# EAGLE design mikro (EAGLE 5.10)
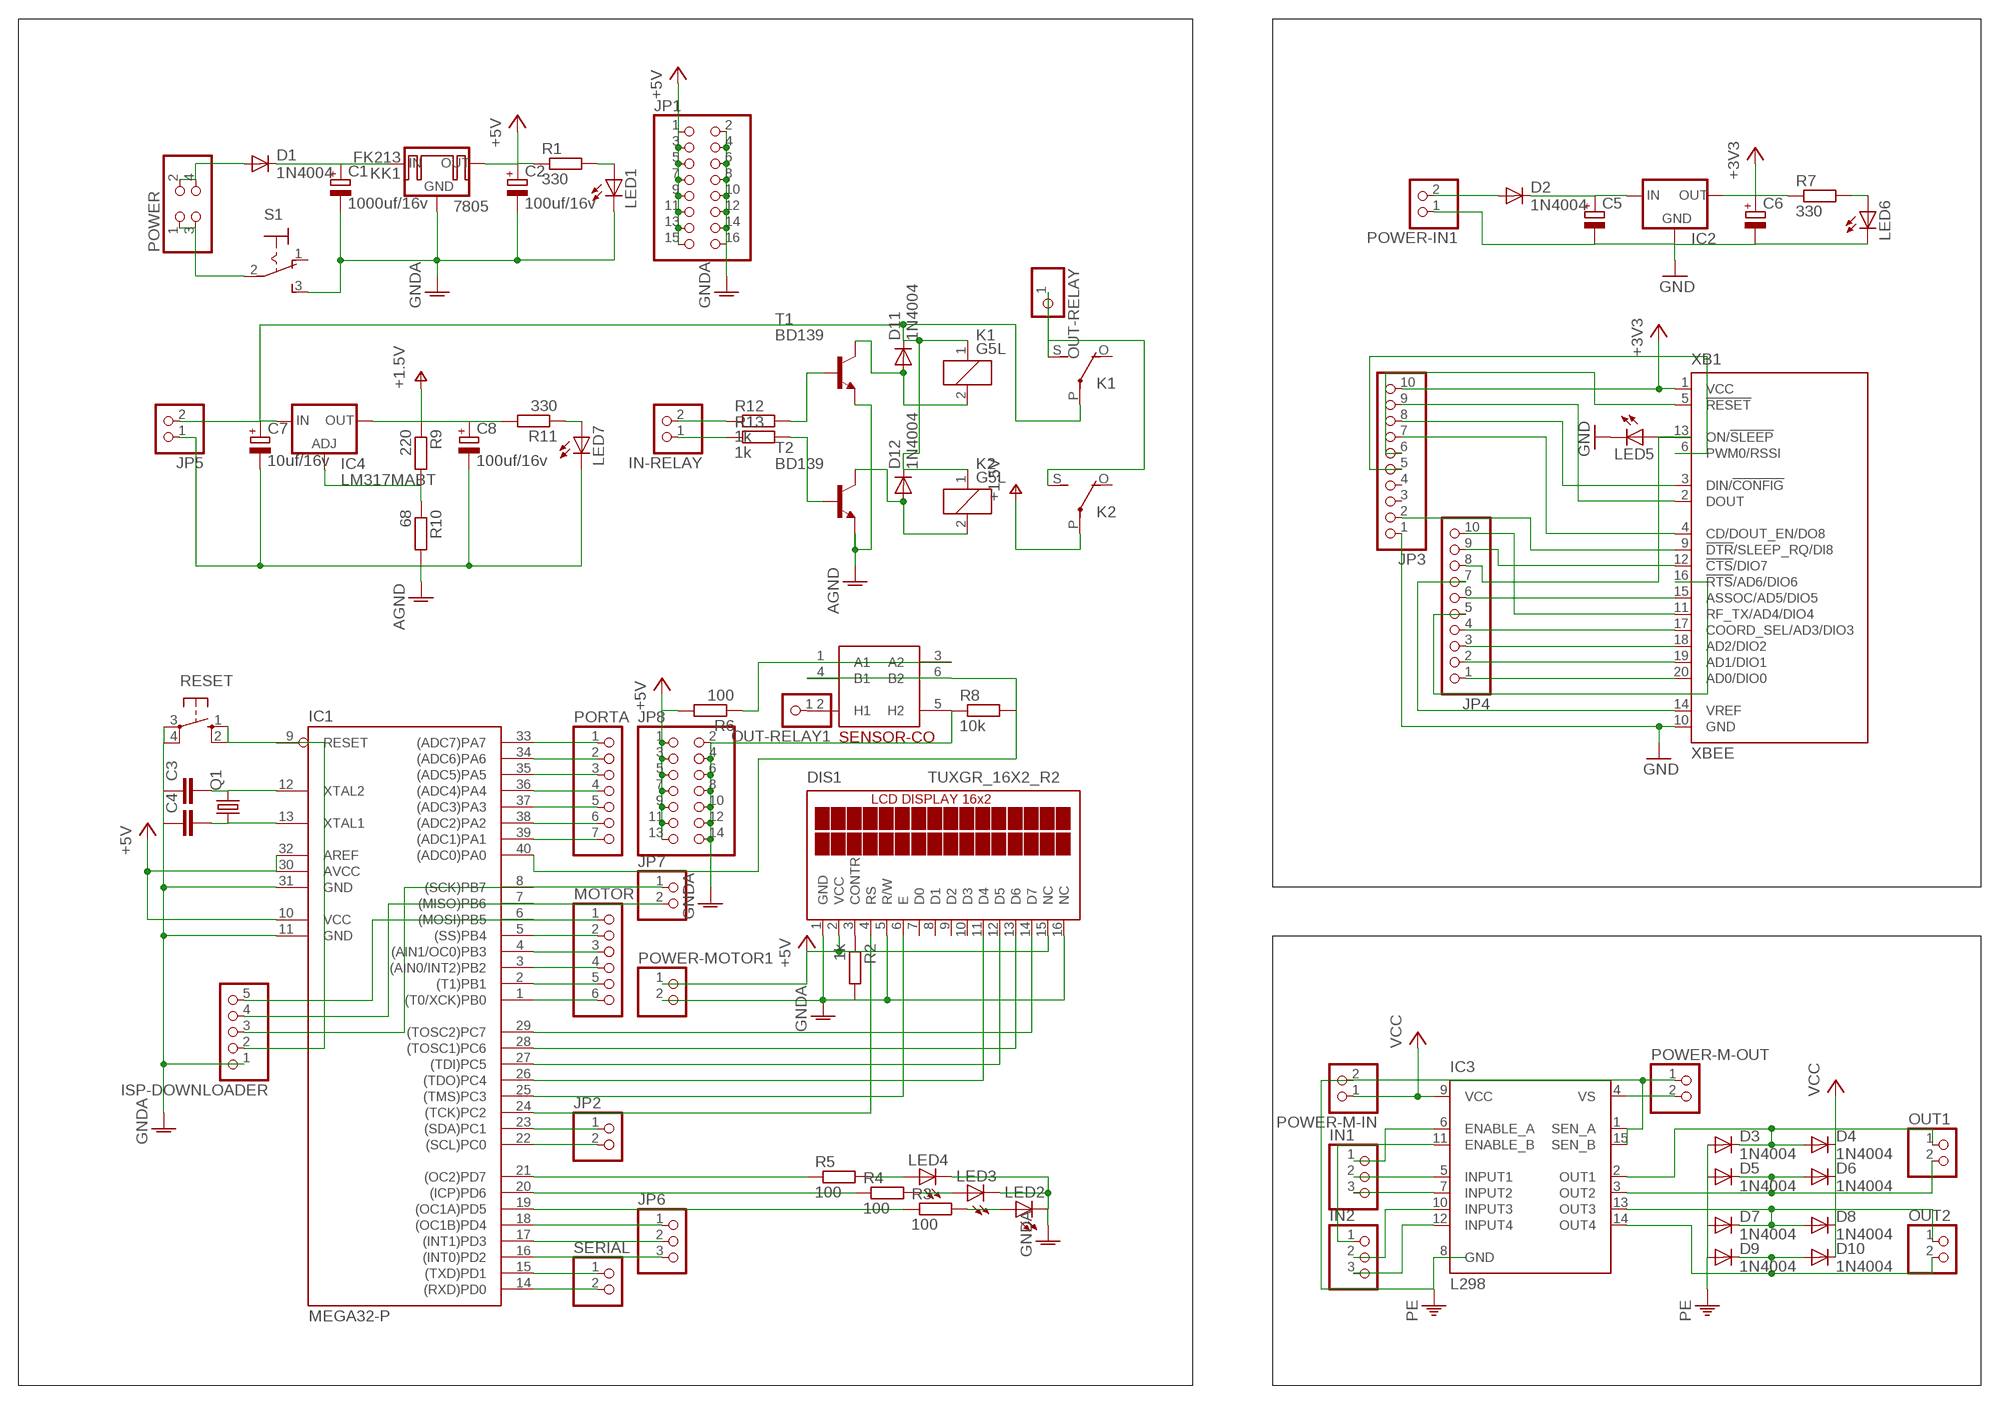
[diagram p0: schematic, sheet 1]

## Parts
7805  78XXS  [78XXS]
C1  1000uf/16v  CPOL-EUE2.5-7  [E2,5-7]
C2  100uf/16v  CPOL-EUE2.5-7  [E2,5-7]
C3  C-EU025-025X050  [C025-025X050]
C4  C-EU025-025X050  [C025-025X050]
C5  CPOL-EUE2.5-7  [E2,5-7]
C6  CPOL-EUE2.5-7  [E2,5-7]
C7  10uf/16v  CPOL-EUE2.5-7  [E2,5-7]
C8  100uf/16v  CPOL-EUE2.5-7  [E2,5-7]
D1  1N4004  [DO41-10]
D2  1N4004  [DO41-10]
D3  1N4004  [DO41-10]
D4  1N4004  [DO41-10]
D5  1N4004  [DO41-10]
D6  1N4004  [DO41-10]
D7  1N4004  [DO41-10]
D8  1N4004  [DO41-10]
D9  1N4004  [DO41-10]
D10  1N4004  [DO41-10]
D11  1N4004  [DO41-10]
D12  1N4004  [DO41-10]
DIS1  TUXGR_16X2_R2  [TUXGR_16X2_R2]
IC1  MEGA32-P  [DIL40]
IC2  78LXX  [78LXX]
IC3  L298  [MULTIWATT-15]
IC4  LM317MABT  [TO220L1]
IN1  PINHD-1X3  [1X03]
IN2  PINHD-1X3  [1X03]
IN-RELAY  PINHD-1X2  [1X02]
ISP-DOWNLOADER  PINHD-1X5  [1X05]
JP1  PINHD-2X8  [2X08]
JP2  PINHD-1X2  [1X02]
JP3  PINHD-1X10  [1X10]
JP4  PINHD-1X10  [1X10]
JP5  PINHD-1X2  [1X02]
JP6  PINHD-1X3  [1X03]
JP7  PINHD-1X2  [1X02]
JP8  PINHD-2X7  [2X07]
K1  G5L  [G5LE]
K2  G5L  [G5LE]
KK1  FK213  [FK213]
LED1  LED5MM  [LED5MM]
LED2  LED5MM  [LED5MM]
LED3  LED5MM  [LED5MM]
LED4  LED5MM  [LED5MM]
LED5  LED5MM  [LED5MM]
LED6  LED5MM  [LED5MM]
LED7  LED5MM  [LED5MM]
MOTOR  PINHD-1X6  [1X06]
OUT1  PINHD-1X2  [1X02]
OUT2  PINHD-1X2  [1X02]
OUT-RELAY  PINHD-1X1  [1X01]
OUT-RELAY1  PINHD-1X1  [1X01]
PORTA  PINHD-1X7  [1X07]
POWER  PINHD-2X2  [2X02]
POWER-IN1  PINHD-1X2  [1X02]
POWER-M-IN  PINHD-1X2  [1X02]
POWER-M-OUT  PINHD-1X2  [1X02]
POWER-MOTOR1  PINHD-1X2  [1X02]
Q1  CRYSTALHC18U-V  [HC18U-V]
R1  330  R-EU_0207/10  [0207/10]
R2  1k  R-EU_0207/10  [0207/10]
R3  100  R-EU_0207/10  [0207/10]
R4  100  R-EU_0207/10  [0207/10]
R5  100  R-EU_0207/10  [0207/10]
R6  100  R-EU_0207/10  [0207/10]
R7  330  R-EU_0207/10  [0207/10]
R8  10k  R-EU_0207/10  [0207/10]
R9  220  R-EU_0207/10  [0207/10]
R10  68  R-EU_0207/10  [0207/10]
R11  330  R-EU_0207/10  [0207/10]
R12  1k  R-EU_0207/10  [0207/10]
R13  1k  R-EU_0207/10  [0207/10]
RESET  10-XX  [B3F-10XX]
S1  320-916  [320-916]
SENSOR-CO  MQ  [MQ]
SERIAL  PINHD-1X2  [1X02]
T1  BD139  [TO126]
T2  BD139  [TO126]
XB1  XBEE  [XBEE]

## Nets
+3V3: C6.+ IC2.OUT JP3.10 R7.1 XB1.1(VCC)
+5V: 7805.OUT C2.+ DIS1.2(VCC) DIS1.15(NC) IC1.10(VCC) IC1.30(AVCC) IC1.32(AREF) JP1.1 JP1.3 JP1.5 JP1.7 JP1.9 JP1.11 JP1.13 JP1.15 JP8.1 JP8.3 JP8.5 JP8.7 JP8.9 JP8.11 JP8.13 POWER-MOTOR1.1 R1.1 R6.2
AGND: C7.- C8.- JP5.1 LED7.K(C) R10.2 T1.1(E) T2.1(E)
GND: C5.- C6.- IC2.GND JP3.1 LED5.K(C) LED6.K(C) POWER-IN1.1 XB1.10(GND)
GNDA: 7805.GND C1.- C2.- C3.1 C4.1 DIS1.1(GND) DIS1.5(R/W) DIS1.16(NC) IC1.11(GND) IC1.31(GND) ISP-DOWNLOADER.1 JP1.2 JP1.4 JP1.6 JP1.8 JP1.10 JP1.12 JP1.14 JP1.16 JP8.2 JP8.4 JP8.6 JP8.8 JP8.10 JP8.12 JP8.14 LED1.K(C) LED2.K(C) LED3.K(C) LED4.K(C) POWER-MOTOR1.2 R2.2 R8.1 RESET.3(P) RESET.4(P1) S1.3(S) SENSOR-CO.5(H2)
N$1: IC1.33((ADC7)PA7) PORTA.1
N$2: IC1.34((ADC6)PA6) PORTA.2
N$3: IC1.35((ADC5)PA5) PORTA.3
N$4: IC1.36((ADC4)PA4) PORTA.4
N$5: IC1.37((ADC3)PA3) PORTA.5
N$6: IC1.38((ADC2)PA2) PORTA.6
N$7: IC1.39((ADC1)PA1) PORTA.7
N$9: IC1.1((T0/XCK)PB0) MOTOR.6
N$10: JP3.9 XB1.2(DOUT)
N$11: LED5.A XB1.13(ON/!SLEEP)
N$12: C5.+ D2.C IC2.IN
N$13: IC1.2((T1)PB1) MOTOR.5
N$14: IC1.3((AIN0/INT2)PB2) MOTOR.4
N$15: DIS1.3(CONTR) R2.1
N$16: DIS1.14(D7) IC1.29((TOSC2)PC7)
N$17: DIS1.13(D6) IC1.28((TOSC1)PC6)
N$18: IC1.4((AIN1/OC0)PB3) MOTOR.3
N$19: IC1.5((SS)PB4) MOTOR.2
N$20: LED4.A R5.2
N$21: IC1.7((MISO)PB6) ISP-DOWNLOADER.4 JP7.2
N$22: LED2.A R3.2
N$23: LED3.A R4.2
N$24: POWER.1 POWER.3 S1.2(P)
N$25: OUT-RELAY1.1 SENSOR-CO.2(H1)
N$26: IC1.19((OC1A)PD5) R3.1
N$27: IC3.4(VS) POWER-M-OUT.2
N$28: DIS1.12(D5) IC1.27((TDI)PC5)
N$29: JP3.8 XB1.3(DIN/!CONFIG)
N$30: DIS1.11(D4) IC1.26((TDO)PC4)
N$31: IC1.20((ICP)PD6) R4.1
N$32: DIS1.6(E) IC1.25((TMS)PC3)
N$33: JP3.7 XB1.4(CD/DOUT_EN/DO8)
N$34: D2.A POWER-IN1.2
N$35: JP3.6 XB1.5(!RESET)
N$36: JP3.5 XB1.6(PWM0/RSSI)
N$37: JP3.2 XB1.9(!DTR!/SLEEP_RQ/DI8)
N$38: JP4.1 XB1.20(AD0/DIO0)
N$39: 7805.IN C1.+ D1.C
N$40: JP4.2 XB1.19(AD1/DIO1)
N$41: LED1.A R1.2
N$42: LED6.A R7.2
N$43: JP4.3 XB1.18(AD2/DIO2)
N$44: JP4.4 XB1.17(COORD_SEL/AD3/DIO3)
N$45: JP4.10 XB1.11(RF_TX/AD4/DIO4)
N$46: JP4.9 XB1.12(!CTS!/DIO7)
N$47: D1.A POWER.2 POWER.4
N$48: JP4.7 XB1.14(VREF)
N$49: JP4.8
N$50: JP4.6 XB1.15(ASSOC/AD5/DIO5)
N$51: JP4.5 XB1.16(!RTS!/AD6/DIO6)
N$52: DIS1.4(RS) IC1.24((TCK)PC2)
N$53: IC1.21((OC2)PD7) R5.1
N$54: IC1.23((SDA)PC1) JP2.1
N$55: IC4.1(ADJ) R9.2 R10.1
N$56: IC1.22((SCL)PC0) JP2.2
N$57: IC1.15((TXD)PD1) SERIAL.1
N$58: IC1.14((RXD)PD0) SERIAL.2
N$59: IC1.16((INT0)PD2) JP6.3
N$60: IC1.17((INT1)PD3) JP6.2
N$61: IC1.18((OC1B)PD4) JP6.1
N$62: IC1.9(RESET) ISP-DOWNLOADER.2 RESET.1(S) RESET.2(S1)
N$63: C3.2 IC1.12(XTAL2) Q1.2
N$64: C4.2 IC1.13(XTAL1) Q1.1
N$65: D3.C D4.A IC3.2(OUT1) OUT1.1
N$66: IC3.5(INPUT1) IN1.2
N$67: IC3.7(INPUT2) IN1.3
N$68: IC3.6(ENABLE_A) IN1.1
N$69: IC3.11(ENABLE_B) IN2.1
N$70: IC3.10(INPUT3) IN2.2
N$71: IC3.12(INPUT4) IN2.3
N$72: IN-RELAY.2 R12.1
N$73: IC1.8((SCK)PB7) ISP-DOWNLOADER.3 JP7.1
N$74: D5.C D6.A IC3.3(OUT2) OUT1.2
N$75: IC1.40((ADC0)PA0) R8.2 SENSOR-CO.4(B1) SENSOR-CO.6(B2)
N$76: D7.C D8.A IC3.13(OUT3) OUT2.1
N$77: IC1.6((MOSI)PB5) ISP-DOWNLOADER.5 MOTOR.1
N$78: D9.C D10.A IC3.14(OUT4) OUT2.2
N$79: IN-RELAY.1 R13.1
N$80: R6.1 SENSOR-CO.1(A1) SENSOR-CO.3(A2)
N$81: LED7.A R11.1
N$82: R12.2 T1.3(B)
N$84: R13.2 T2.3(B)
N$85: C7.+ D11.C D12.C IC4.3(IN) JP5.2 K1.1 K1.P(2:P) K2.1
N$86: D12.A K2.2 T2.2(C)
N$87: D11.A K1.2 T1.2(C)
N$94: K1.S(2:S) K2.S(2:S) OUT-RELAY.1
PE: D3.A D5.A D7.A D9.A IC3.1(SEN_A) IC3.8(GND) IC3.15(SEN_B) POWER-M-IN.2 POWER-M-OUT.1
V+: C8.+ IC4.2(OUT) K2.P(2:P) R9.1 R11.2 ; supply symbol labelled +1.5V
VCC: D4.C D6.C D8.C D10.C IC3.9(VCC) POWER-M-IN.1
Unconnected: DIS1.7(D0) DIS1.8(D1) DIS1.9(D2) DIS1.10(D3) JP3.3 JP3.4 K1.O(2:O) K2.O(2:O) S1.1(O)

## Notes on the sheet
- SENSOR-CO

## Library data of the parts
7805 = v-reg:78XXS: VOLTAGE REGULATOR
C1 C2 C5-C8 = rcl:CPOL-EU: POLARIZED CAPACITOR, European symbol
C3 C4 = rcl:C-EU: CAPACITOR, European symbol
D1-D12 = diode:1N4004: DIODE general purpose rectifier, 1 A
DIS1 = display-lcd:TUXGR_16X2_R2: Tuxgraphics LCD display 16x2 characters reflective, without background light Source: tuxgr_12x2_r2.pdf
IC1 = atmel:MEGA32-P: MICROCONTROLLER 32 Kbytes FLASH 2 Kbytes SRAM 1 Kbytes EEPROM USART 8-channel 10 bit ADC Source: www.atmel.com .. doc2503.pdf
IC2 = v-reg:78LXX: VOLTAGE REGULATOR
IC3 = st-microelectronics:L298: DUAL FULL-BRIDGE DRIVER
IC4 = v-reg:LM317?*: 500 mA Adjustable Output Positive Voltage Regulator Source: http://www.onsemi.co.jp .. LM317M-D.PDF
IN1 IN2 JP6 = pinhead:PINHD-1X3: PIN HEADER
IN-RELAY JP2 JP5 JP7 OUT1 OUT2 POWER-IN1 POWER-M-IN POWER-M-OUT POWER-MOTOR1 SERIAL = pinhead:PINHD-1X2: PIN HEADER
ISP-DOWNLOADER = pinhead:PINHD-1X5: PIN HEADER
JP1 = pinhead:PINHD-2X8: PIN HEADER
JP3 JP4 = pinhead:PINHD-1X10: PIN HEADER
JP8 = pinhead:PINHD-2X7: PIN HEADER
K1 K2 = relay:G5L: RELAY 1 x switch, 10 A/120 V AC, 8 A/30 V ADC, Omron
KK1 = heatsink:FK213: HEATSINK manufacturer Fischer/distributor Buerklin
LED1-LED7 = led:LED: LED OSRAM: - CHIPLED LG R971, LG N971, LY N971, LG Q971, LY Q971, LO R971, LY R971 LH N974, LH R974 LS Q976, LO Q976, LY Q976 LO Q996 - Hyper CHIPLED LW Q18S LB Q993, LB Q99A, LB R99A - SideLED LS A670, LO A670, LY A670, LG A670, LP A670 LB A673, LV A673, LT A673, LW A673 LH A674 LY A675 LS A676, LA A676, LO A676, LY A676, LW A676 LS A679, LY A679, LG A679 - Hyper Micro SIDELED® LS Y876, LA Y876, LO Y876, LY Y876 LT Y87S - SmartLED LW L88C, LW L88S LB L89C, LB L89S, LG L890 LS L89K, LO L89K, LY L89K LS L896, LA L896, LO L896, LY L896 - TOPLED LS T670, LO T670, LY T670, LG T670, LP T670 LSG T670, LSP T670, LSY T670, LOP T670, LYG T670 LG T671, LOG T671, LSG T671 LB T673, LV T673, LT T673, LW T673 LH T674 LS T676, LA T676, LO T676, LY T676, LB T676, LH T676, LSB T676, LW T676 LB T67C, LV T67C, LT T67C, LS T67K, LO T67K, LY T67K, LW E67C LS E67B, LA E67B, LO E67B, LY E67B, LB E67C, LV E67C, LT E67C LW T67C LS T679, LY T679, LG T679 LS T770, LO T770, LY T770, LG T770, LP T770 LB T773, LV T773, LT T773, LW T773 LH T774 LS E675, LA E675, LY E675, LS T675 LS T776, LA T776, LO T776, LY T776, LB T776 LHGB T686 LT T68C, LB T68C - Hyper Mini TOPLED® LB M676 - Mini TOPLED Santana® LG M470 LS M47K, LO M47K, LY M47K Source: http://www.osram.convergy.de LUXEON: - LUMILED® LXK2-PW12-R00, LXK2-PW12-S00, LXK2-PW14-U00, LXK2-PW14-V00 LXK2-PM12-R00, LXK2-PM12-S00, LXK2-PM14-U00 LXK2-PE12-Q00, LXK2-PE12-R00, LXK2-PE12-S00, LXK2-PE14-T00, LXK2-PE14-U00 LXK2-PB12-K00, LXK2-PB12-L00, LXK2-PB12-M00, LXK2-PB14-N00, LXK2-PB14-P00, LXK2-PB14-Q00 LXK2-PR12-L00, LXK2-PR12-M00, LXK2-PR14-Q00, LXK2-PR14-R00 LXK2-PD12-Q00, LXK2-PD12-R00, LXK2-PD12-S00 LXK2-PH12-R00, LXK2-PH12-S00 LXK2-PL12-P00, LXK2-PL12-Q00, LXK2-PL12-R00 Source: www.luxeon.com KINGBRIGHT: KA-3528ASYC Source: www.kingbright.com
MOTOR = pinhead:PINHD-1X6: PIN HEADER
OUT-RELAY OUT-RELAY1 = pinhead:PINHD-1X1: PIN HEADER
PORTA = pinhead:PINHD-1X7: PIN HEADER
POWER = pinhead:PINHD-2X2: PIN HEADER
Q1 = crystal:CRYSTAL: CRYSTAL
R1-R13 = rcl:R-EU_: RESISTOR, European symbol
RESET = switch-omron:10-XX: OMRON SWITCH
S1 = switch:320-916: TOGGLE SWITCH distributor RS Components
SENSOR-CO = MQ:MQ
T1 T2 = transistor:BD139: NPN TRANSISTOR
XB1 = maxstream:XBEE: XBee (TM) /XBee-PRO(TM) OEM RF Modules Source: MaxStream, Inc. xbee_productmanual.pdf

## Board
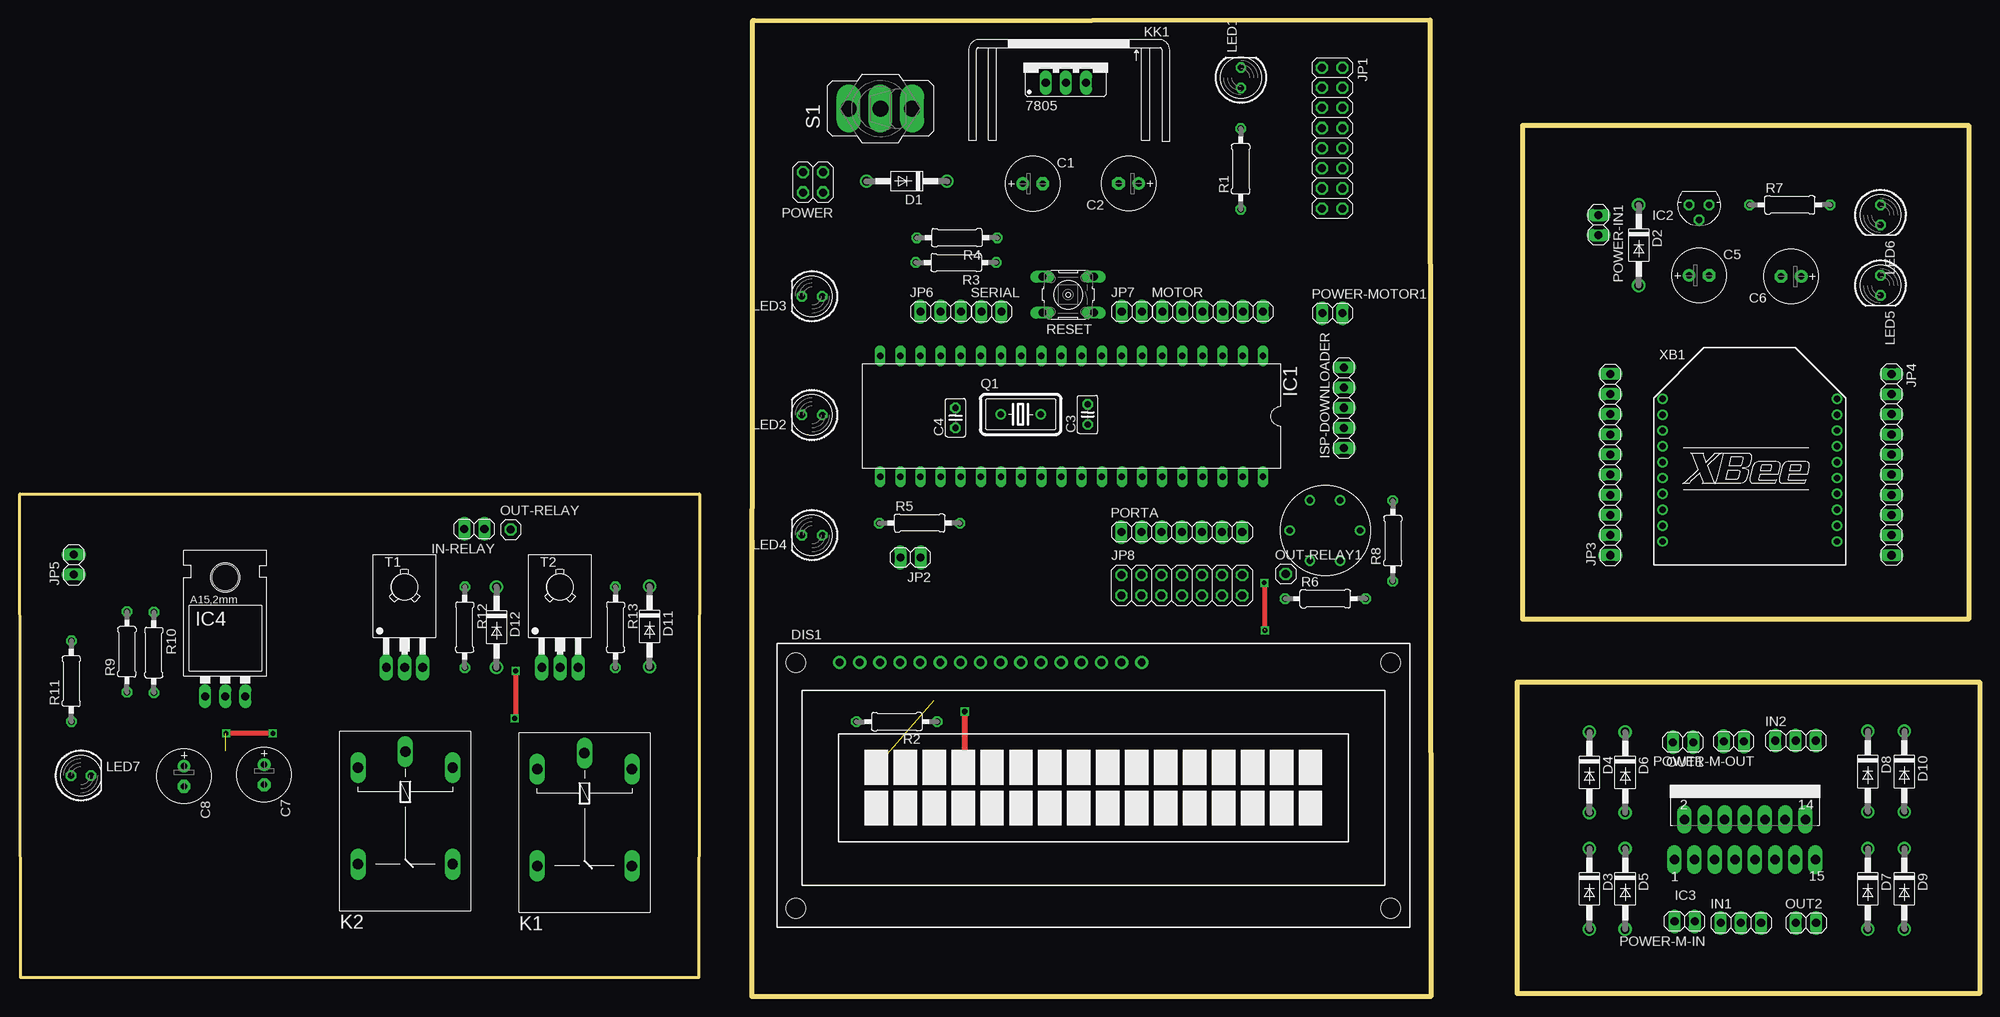
[diagram p1: board, top side]
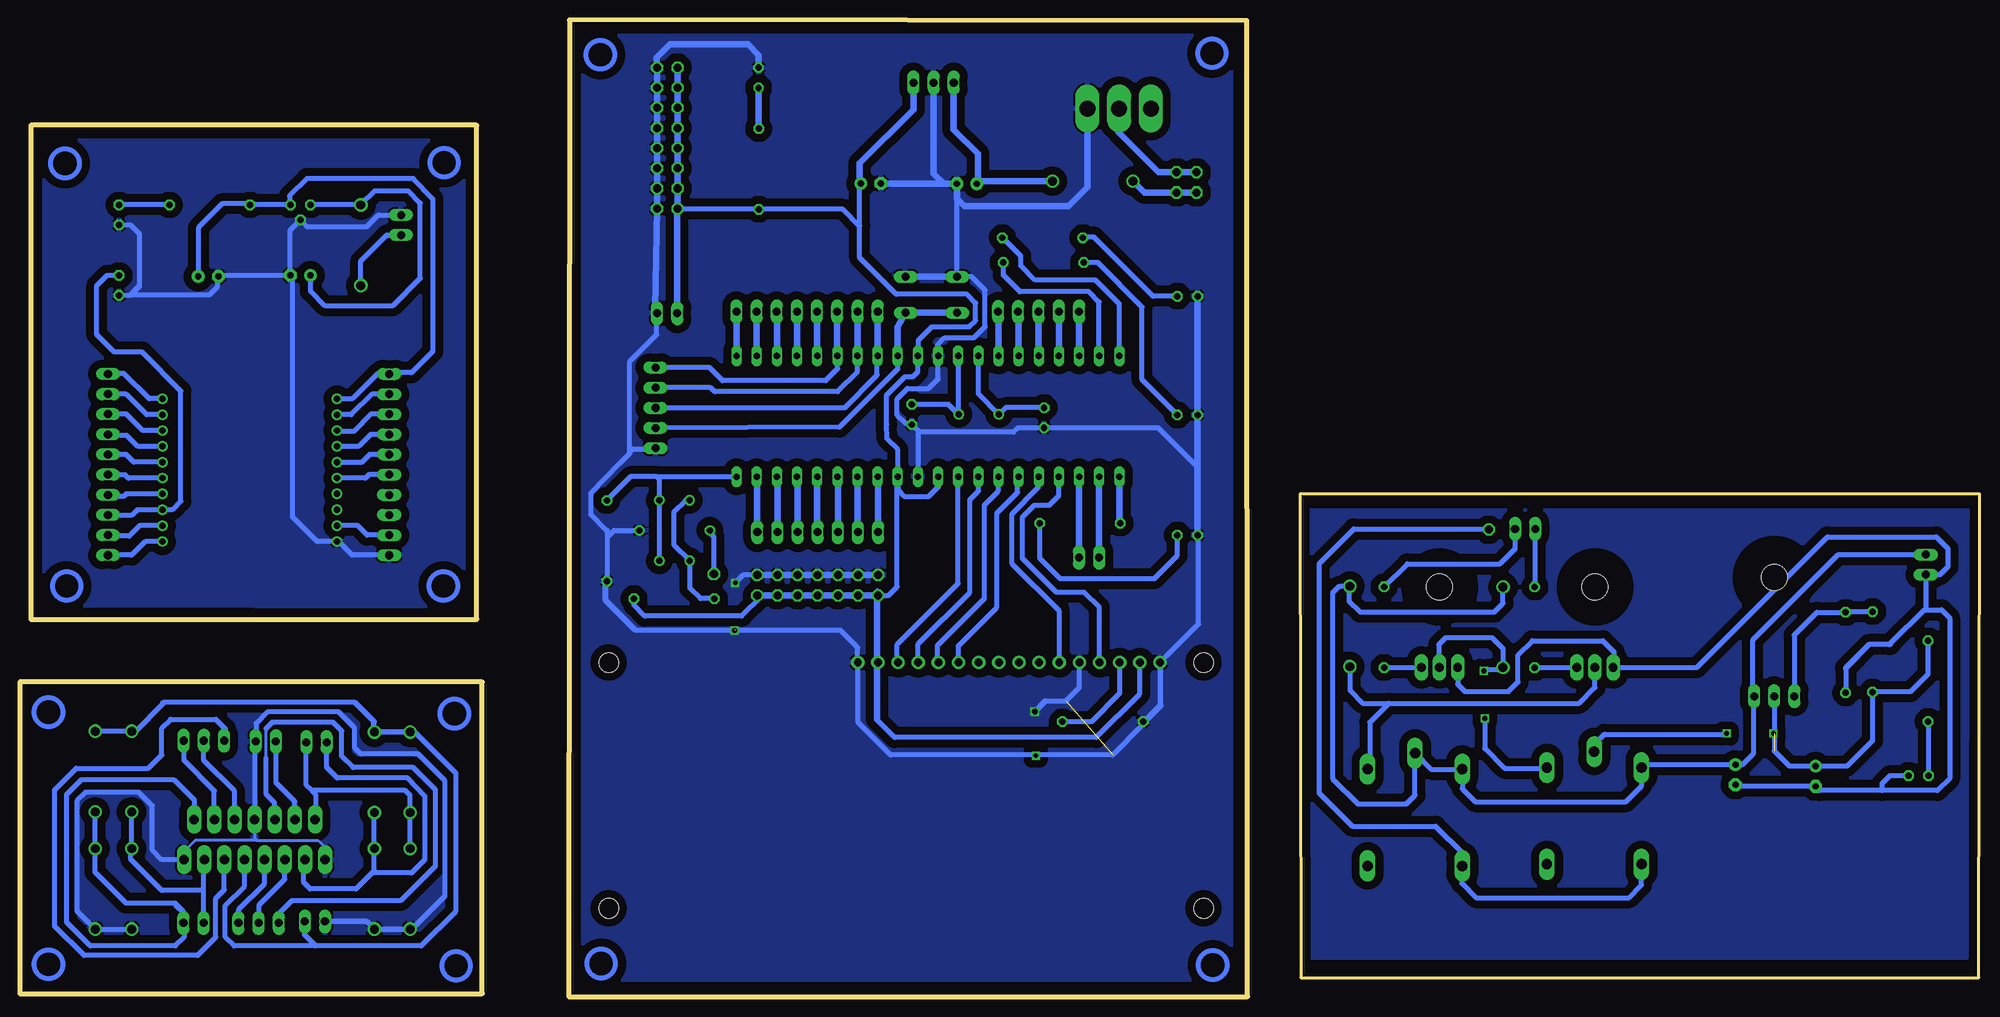
[diagram p2: board, bottom side, seen from below]

Size 247.1 x 123.2 mm. Coordinates in mm from the lower left corner, seen from the top.
Outline: 92.6,123.1 177.8,123.2 177.9,0 92.3,0 92.4,123.1
Outline: 189.5,109.9 245.7,109.9 245.7,47.6 189.5,47.6 189.5,109.9
Outline: 247.1,39.7 247.1,0.4 188.8,0.4 188.8,39.7 247.1,39.7
Outline: 85.7,63.4 85.6,2.4 0.1,2.4 0,63.4 85.7,63.4
Copper layers (1*16): Top 0.035mm / dielectric 1.5mm / Bottom 0.035mm
Design rules "default": minimum track width 10mil, minimum drill 24mil, track to track 8mil, track to pad 8mil, pad to pad 8mil, via to via 8mil, smd to smd 8mil, copper to edge 40mil, drill to drill 8mil, minimum pad ring 10mil, minimum via ring 8mil, stop-mask expansion 4mil, vias tented up to drill 0mil, thermal gap 10mil

### Footprints (pad centres in the part's own frame; a part is rotated, then mirrored left to right if it is on the bottom)
78XXS = drill 1.016 long: GND 0,-2.54; IN -2.54,-2.54; OUT 2.54,-2.54
E2,5-7 = drill 0.813 pad 1.6 round: + -1.27,0 | drill 0.813 pad 1.6 octagon: - 1.27,0
C025-025X050 = drill 0.813 octagon: 1 -1.27,0; 2 1.27,0
DO41-10 = drill 1.118 round: A 5.08,0; C -5.08,0
TUXGR_16X2_R2 = drill 1 pad 1.676 round: 1 -32,15.5; 2 -29.46,15.5; 3 -26.92,15.5; 4 -24.38,15.5; 5 -21.84,15.5; 6 -19.3,15.5; 7 -16.76,15.5; 8 -14.22,15.5; 9 -11.68,15.5; 10 -9.14,15.5; 11 -6.6,15.5; 12 -4.06,15.5; 13 -1.52,15.5; 14 1.02,15.5; 15 3.56,15.5; 16 6.1,15.5 | hole 2.5: -37.5,-15.5; 37.5,-15.5; -37.5,15.5; 37.5,15.5
DIL40 = drill 0.813 long: 1 -24.13,-7.62; 2 -21.59,-7.62; 3 -19.05,-7.62; 4 -16.51,-7.62; 5 -13.97,-7.62; 6 -11.43,-7.62; 7 -8.89,-7.62; 8 -6.35,-7.62; 9 -3.81,-7.62; 10 -1.27,-7.62; 11 1.27,-7.62; 12 3.81,-7.62; 13 6.35,-7.62; 14 8.89,-7.62; 15 11.43,-7.62; 16 13.97,-7.62; 17 16.51,-7.62; 18 19.05,-7.62; 19 21.59,-7.62; 20 24.13,-7.62; 21 24.13,7.62; 22 21.59,7.62; 23 19.05,7.62; 24 16.51,7.62; 25 13.97,7.62; 26 11.43,7.62; 27 8.89,7.62; 28 6.35,7.62; 29 3.81,7.62; 30 1.27,7.62; 31 -1.27,7.62; 32 -3.81,7.62; 33 -6.35,7.62; 34 -8.89,7.62; 35 -11.43,7.62; 36 -13.97,7.62; 37 -16.51,7.62; 38 -19.05,7.62; 39 -21.59,7.62; 40 -24.13,7.62
78LXX = drill 0.813 octagon: GND 0,1.905; IN 1.27,0; OUT -1.27,0
MULTIWATT-15 = drill 1.2 long: 1 -8.89,-7.62; 2 -7.62,-2.54; 3 -6.35,-7.62; 4 -5.08,-2.54; 5 -3.81,-7.62; 6 -2.54,-2.54; 7 -1.27,-7.62; 8 0,-2.54; 9 1.27,-7.62; 10 2.54,-2.54; 11 3.81,-7.62; 12 5.08,-2.54; 13 6.35,-7.62; 14 7.62,-2.54; 15 8.89,-7.62
TO220L1 = drill 1.016 long: 1 -2.54,-3.81; 2 0,-3.81; 3 2.54,-3.81 | hole 3.302: 0,11.176
1X03 = drill 1.016 long: 1 -2.54,0; 2 0,0; 3 2.54,0
1X02 = drill 1.016 long: 1 -1.27,0; 2 1.27,0
1X05 = drill 1.016 long: 1 -5.08,0; 2 -2.54,0; 3 0,0; 4 2.54,0; 5 5.08,0
2X08 = drill 1.016 octagon: 1 -8.89,-1.27; 2 -8.89,1.27; 3 -6.35,-1.27; 4 -6.35,1.27; 5 -3.81,-1.27; 6 -3.81,1.27; 7 -1.27,-1.27; 8 -1.27,1.27; 9 1.27,-1.27; 10 1.27,1.27; 11 3.81,-1.27; 12 3.81,1.27; 13 6.35,-1.27; 14 6.35,1.27; 15 8.89,-1.27; 16 8.89,1.27
1X10 = drill 1.016 long: 1 -11.43,0; 2 -8.89,0; 3 -6.35,0; 4 -3.81,0; 5 -1.27,0; 6 1.27,0; 7 3.81,0; 8 6.35,0; 9 8.89,0; 10 11.43,0
2X07 = drill 1.016 octagon: 1 -7.62,-1.27; 2 -7.62,1.27; 3 -5.08,-1.27; 4 -5.08,1.27; 5 -2.54,-1.27; 6 -2.54,1.27; 7 0,-1.27; 8 0,1.27; 9 2.54,-1.27; 10 2.54,1.27; 11 5.08,-1.27; 12 5.08,1.27; 13 7.62,-1.27; 14 7.62,1.27
G5LE = drill 1.321 long: 1 -7.493,-5.969; 2 -7.493,5.969; O 4.699,5.969; P -9.525,0; S 4.699,-5.969
LED5MM = drill 0.813 octagon: A -1.27,0; K 1.27,0
1X06 = drill 1.016 long: 1 -6.35,0; 2 -3.81,0; 3 -1.27,0; 4 1.27,0; 5 3.81,0; 6 6.35,0
1X01 = drill 1.016 octagon: 1 0,0
1X07 = drill 1.016 long: 1 -7.62,0; 2 -5.08,0; 3 -2.54,0; 4 0,0; 5 2.54,0; 6 5.08,0; 7 7.62,0
2X02 = drill 1.016 octagon: 1 -1.27,-1.27; 2 -1.27,1.27; 3 1.27,-1.27; 4 1.27,1.27
HC18U-V = drill 0.813 round: 1 -2.54,0; 2 2.54,0
0207/10 = drill 0.813 octagon: 1 -5.08,0; 2 5.08,0
B3F-10XX = drill 1.016 long: 1 -3.251,2.261; 2 3.251,2.261; 3 -3.251,-2.261; 4 3.251,-2.261
320-916 = drill 2.007 long: 1 0,4.013; 2 0,0; 3 0,-4.013
MQ = drill 0.8 round: 1 -3.81,2.54; 2 0,5.08; 3 3.81,2.54; 4 -3.81,-1.27; 5 0,-3.81; 6 3.81,-1.27
TO126 = drill 1.118 long: 1 -2.286,-5.08; 2 0,-5.08; 3 2.286,-5.08 | hole 3.302: 0,5.08
XBEE = drill 0.8 pad 1.27 round: 1 -11,9; 2 -11,7; 3 -11,5; 4 -11,3; 5 -11,1; 6 -11,-1; 7 -11,-3; 8 -11,-5; 9 -11,-7; 10 -11,-9; 11 11,-9; 12 11,-7; 13 11,-5; 14 11,-3; 15 11,-1; 16 11,1; 17 11,3; 18 11,5; 19 11,7; 20 11,9

### Placement (x,y rotation side)
7805  131.89,117.81 0 top
C1  127.7,102.54 0 top
C2  139.8,102.56 180 top
C3  134.63,73.43 90 top
C4  117.97,73.02 90 top
C5  211.73,90.97 0 top
C6  223.34,90.83 180 top
C7  30.8,28 270 top
C8  20.7,27.8 270 top
D1  111.83,102.85 180 top
D2  204.11,94.78 270 top
D3  197.9,13.6 270 top
D4  197.9,28.3 270 top
D5  202.4,13.6 270 top
D6  202.4,28.3 270 top
D7  233,13.6 270 top
D8  233,28.4 270 top
D9  237.6,13.6 270 top
D10  237.6,28.4 270 top
D11  79.4,46.7 270 top
D12  60.1,46.6 270 top
DIS1  135.35,26.65 0 top
IC1  132.6,73.2 180 top
IC2  211.73,99.86 180 top
IC3  217.5,24.9 0 top
IC4  25.9,41.7 0 top
IN1  217,9.3 0 top
IN2  223.9,32.3 0 top
IN-RELAY  57.3,59 180 top
ISP-DOWNLOADER  166.96,74.27 90 top
JP1  165.46,108.29 270 top
JP2  112.3,55.4 180 top
JP3  200.53,67.11 90 top
JP4  235.99,67.11 270 top
JP5  6.8,54.5 90 top
JP6  116.1,86.4 0 top
JP7  140.2,86.4 0 top
JP8  146.5,51.9 0 top
K1  71.2,21.2 270 top
K2  48.6,21.4 270 top
KK1  132.3,119.7 180 top
LED1  153.96,115.9 90 top
LED2  99.88,73.36 180 top
LED3  99.88,88.34 180 top
LED4  99.88,58.22 180 top
LED5  234.59,89.7 270 top
LED6  234.59,98.59 270 top
LED7  7.7,27.9 0 top
MOTOR  150.4,86.4 0 top
OUT1  209.7,32.1 180 top
OUT2  225.2,9.3 0 top
OUT-RELAY  61.9,58.9 0 top
OUT-RELAY1  159.6,53.3 0 top
PORTA  146.5,58.6 0 top
POWER  100,102.7 180 top
POWER-IN1  199.03,97.32 270 top
POWER-M-IN  209.9,9.5 180 top
POWER-M-OUT  216.1,32.2 180 top
POWER-MOTOR1  165.5,86.2 0 top
Q1  126.19,73.45 0 top
R1  153.93,104.4 90 top
R2  110.57,34.69 180 top
R3  118.05,92.59 180 top
R4  118.15,95.73 180 top
R5  113.45,59.73 0 top
R6  164.6,50.2 0 top
R7  223.16,99.86 0 top
R8  173.1,57.5 90 top
R9  13.5,43.5 90 top
R10  16.9,43.4 270 top
R11  6.5,39.8 90 top
R12  56.1,46.6 270 top
R13  75.1,46.6 270 top
RESET  132.17,88.53 180 top
S1  108.5,112 90 top
SENSOR-CO  165.2,58.8 90 top
SERIAL  122.5,86.38 0 top
T1  48.5,46.6 0 top
T2  68.1,46.6 0 top
XB1  218.11,66.41 0 top

### Tracks (layer width: path | path; a pad name or v marks a point on that pad's centre or on a via)
+3V3
  Bottom 0.61: C6.+ 224.61,96.99 221.6,100 218.22,100 R7.1 IC2.OUT 213.1,99.96 213.1,101 210.9,103.2 197.5,103.2 195,100.6 195,81.4 197.7,78.7 200.37,78.7 JP3.10 202.06,78.54 205.2,75.4 XB1.1 207.11,75.49
+5V
  Bottom 0.61: IC1.30 131.33,64.27 132.5,63.1 135.6,63.1 136.4,63.9 IC1.32 | 133.87,80.3 133.87,78.83 134.5,78.2 135.5,78.2 137.8,75.9 137.8,72.2 137.75,70.35 136.4,69 136.4,65.99 IC1.32 | 133.87,80.3 IC1.10 | 138.91,34.81 DIS1.15 138.91,51.11 139,51.2 139,50.75 JP8.1 137.57,50.63 136.5,51.7 136.5,65.49 IC1.32 | 138.91,34.81 136.8,32.7 111.4,32.7 105.9,38.2 DIS1.2 | R6.2 169.68,49.38 168.3,48 156.1,48 153.6,50.5 139,50.5 139.1,50.4 139.1,35 138.91,34.81 | 141.2,97.2 141.2,93.2 136.6,88.6 127.7,88.6 126.6,87.5 126.6,85.3 127.4,84.5 132.1,84.5 133.8,82.8 133.8,80.37 133.87,80.3 | 141.2,97.2 141.2,102.69 | 141.2,97.2 143.32,99.32 R1.1 164.11,99.32
  Bottom 0.813: JP1.1 JP1.3 JP1.5 JP1.7 JP1.9 JP1.11 JP1.13 JP1.15 | JP8.13 JP8.11 JP8.9 JP8.7 JP8.5 JP8.3 JP8.1 | 7805.OUT 134.43,111.87 141.2,105.1 141.2,102.69 C2.+ | 164.11,99.32 JP1.15 | POWER-MOTOR1.1 164.23,99.36 JP1.15
AGND
  Bottom 0.61: C7.- 30.6,26.53 C8.- 20.17,26 12.3,26 | 7,48.8 6.8,49 JP5.1 6.77,53.2 5,53.2 4,54.2 4,56.5 5.5,58 19.2,58 35.68,41.52 T1.1 46.1,41.63 46.1,43.5 47.5,44.9 56.4,44.9 58.2,43.1 58.2,39.7 59.4,38.5 64.9,38.5 65.81,39.41 T2.1 | 11.2,44.6 11.4,44.4 13.9,44.4 16.9,41.4 R10.2 16.9,41.5 14,44.4 11.3,44.4 11.2,44.5 11.2,44.6 | 7,48.8 11.2,44.6 | 7,48.8 4.8,48.8 3.8,47.8 3.8,27.5 5.3,26 12.3,26 | LED7.K 11.3,27.9 12.3,26.9 12.3,26
GND
  Bottom 0.61: 200.45,55.6 199.9,55.6 200,55.7 205.2,55.7 206.91,57.41 XB1.10 209.61,57.41 212.7,60.5 212.7,90.67 C5.- | C5.- 221.93,90.97 C6.- 222.2,90.7 222.2,89.5 223.2,88.5 233.2,88.5 232.1,89.6 232,89.6 | LED5.K 233.17,88.43 232,89.6 | 232,89.6 232,96.2 233.1,97.3 234.57,97.3 LED6.K | POWER-IN1.1 201.91,98.59 203.4,97.1 210.88,97.1 IC2.GND 213,96.69 C5.-
  pour Bottom (isolate 1.016): 244.1,107.9 244.2,49.4 190.8,49.3 190.9,107.9
GNDA  (via drill 0.6)  (2 unrouted)
  Top 0.61: v119.2,36 119.2,30.7 119,30.5 | v119.1,35.9 v119.1,36 | v119.1,35.9 119.1,30.5 | v156.9,52.2 156.9,46.3 156.8,46.2 | v119.1,35.9 119.1,30.7 119.3,30.5
  Bottom 0.61: 128,99.7 128.92,100.58 RESET.4 127.09,90.79 125.4,89.1 125.4,84.5 126.8,83.1 130.5,83.1 131.4,82.2 131.4,80.89 IC1.11 131.33,77.87 132.5,76.7 135.2,76.7 136.5,75.4 136.5,73.3 135.4,72.3 134.77,72.3 C3.1 133.87,71.4 | 133.87,71.4 133.67,71.2 121.8,71.2 121.25,71.75 C4.1 103.56,71.75 98.61,66.8 | ISP-DOWNLOADER.1 167.05,69.1 169.8,69.1 170.2,68.7 | 133.87,71.4 IC1.31 | R2.2 105.21,34.69 103.2,36.7 103.2,42 DIS1.1 | 98.49,58.1 98.49,47.01 DIS1.1 | DIS1.1 103.35,36.75 105.6,34.5 105.6,34.2 109.3,30.5 137.3,30.5 141.4,34.6 141.4,42.1 DIS1.16 141.45,44.05 143.6,46.2 v157,46.2 169.4,46.2 | DIS1.5 113.51,38.99 115.2,37.3 117.7,37.3 | 169.4,46.2 173.2,50 173.2,52.32 | 169.4,46.2 169.5,46.2 173.3,50 173.3,52.5 173,52.8 173,58 | 173,58 173,58.8 173.1,58.8 175.1,60.8 175.1,63.5 171.4,67.3 170.2,68.5 170.2,68.7 | 170.2,68.7 170.2,80.1 166.8,83.5 166.8,86.17 POWER-MOTOR1.2 | 117.7,37.3 117.8,37.3 | v119.1,36 117.8,37.3 | 117.8,37.3 117.9,37.3 v119.2,36 119.2,36.2 | SENSOR-CO.5 172.2,58.8 173,58 | JP8.6 155.93,53.17 v156.9,52.2 | v119.1,35.9 117.7,37.3
  Bottom 0.813: RESET.4 RESET.3 | JP8.2 JP8.4 JP8.6 JP8.8 JP8.10 JP8.12 JP8.14 | LED3.K LED2.K 98.61,66.8 98.61,58.71 98.6,58.1 98.49,58.1 LED4.K | S1.3 112.5,111.99 112.5,102.1 114.9,99.7 128,99.7 128.97,100.67 C1.- 130.6,102.54 | 130.6,102.54 138.51,102.54 C2.- | 7805.GND 131.89,103.83 130.6,102.54 | POWER-MOTOR1.2 167,86.2 167,86.8 166.77,99.36 JP1.16 JP1.14 JP1.12 JP1.10 JP1.8 JP1.6 JP1.4 JP1.2 166.8,117.25 166.8,118.4 165.1,120.1 155.3,120.1 153.96,118.76 LED1.K
  pour Bottom (isolate 1.016): 94.5,121.1 176.1,121.1 176.1,2.2 94.4,2.2 94.4,121
N$1
  Bottom 0.813: PORTA.1 138.88,65.51 IC1.33
N$2
  Bottom 0.813: IC1.34 141.49,58.67 PORTA.2
N$3
  Bottom 0.813: PORTA.3 143.96,65.51 IC1.35
N$4
  Bottom 0.813: IC1.36 146.57,58.67 PORTA.4
N$5
  Bottom 0.813: PORTA.5 149.04,65.51 IC1.37
N$6
  Bottom 0.813: PORTA.6 151.58,65.51 IC1.38
N$7
  Bottom 0.813: PORTA.7 154.12,65.51 IC1.39
N$8  (via drill 0.6)
  other vias: 119,30.4
N$9
  Bottom 0.813: IC1.1 156.75,80.82 MOTOR.6
N$10
  Bottom 0.61: JP3.9 202.7,76 205.3,73.4 XB1.2
N$11
  Bottom 0.61: LED5.A 234.62,91 236.1,91 237.4,89.7 237.4,83.5 235.2,81.3 231.7,81.3 226.8,76.4 226.8,62.5 227.89,61.41 XB1.13 232.29,61.41 233,60.7 235.8,60.7 235.9,60.8
N$12
  Bottom 0.61: IC2.IN D2.C 202.37,101.6 198.1,101.6 196.6,100.1 196.6,90.6 200.1,87.1 208.6,87.1 210.46,88.96 C5.+
N$13
  Bottom 0.813: MOTOR.5 154.19,86.5 IC1.2
N$14
  Bottom 0.813: MOTOR.4 151.65,86.5 IC1.3
N$15
  Bottom 0.61: R2.1 112.01,34.69 108.4,38.3 108.4,42.12 DIS1.3
N$16
  Bottom 0.61: IC1.29 128.79,52.11 136.5,44.4 136.5,42.28 DIS1.14
N$17
  Bottom 0.61: DIS1.13 133.83,44.47 127.3,51 127.3,62.7 126.2,63.8 126.2,65.53 IC1.28
N$18
  Bottom 0.813: MOTOR.3 149.11,86.5 IC1.4
N$19
  Bottom 0.813: MOTOR.2 146.57,86.5 IC1.5
N$20
  Bottom 0.61: LED4.A 101.15,55.65 104.1,52.7 115.9,52.7 118.5,55.3 118.5,59.7 R5.2
N$21
  Bottom 0.61: ISP-DOWNLOADER.4 160.01,76.81 159.5,76.3 144,76.3 141.5,78.8 IC1.7
  Bottom 0.813: JP7.2 141.47,80.94 IC1.7
N$22
  Bottom 0.61: R3.2 111.19,92.59 105.6,87 105.6,77.81 LED2.A
N$23
  Bottom 0.61: LED3.A 104.24,88.34 111.7,95.8 113,95.8 R4.2
N$24
  Bottom 0.813: POWER.3 POWER.1 103.57,103.97 108.6,109 108.6,111.9 S1.2
N$25
  Bottom 0.61: SENSOR-CO.2 160.12,58.52 159.6,58 OUT-RELAY1.1 160,52.9
N$26
  Bottom 0.61: IC1.19 111.01,87.61 112.3,88.9 121,88.9 123.1,91 123.1,92.56 R3.1
N$27
  Bottom 0.61: IC3.4 212.42,24.62 214.8,27 214.8,32.17 POWER-M-OUT.2
N$28
  Bottom 0.61: IC1.27 123.71,63.79 125.5,62 125.5,50.2 131.4,44.3 131.4,42.26 DIS1.12
N$29
  Bottom 0.61: JP3.8 202.84,73.46 205,71.3 207,71.3 XB1.3
N$30
  Bottom 0.61: DIS1.11 128.75,44.25 123.9,49.1 123.9,61 121.3,63.6 121.3,65.45 IC1.26
N$31
  Bottom 0.61: IC1.20 108.47,87.37 111.5,90.4 119.1,90.4 120.9,92.2 120.9,93.4 R4.1
N$32
  Bottom 0.61: DIS1.6 116.05,48.65 122,54.6 122,60.9 118.7,64.2 118.7,65.51 IC1.25
N$33
  Bottom 0.61: JP3.7 202.88,70.92 204.4,69.4 XB1.4
N$34
  Bottom 0.61: POWER-IN1.2 200.85,96.05 204.1,92.8 D2.A
N$35
  Bottom 0.61: JP3.6 203.02,68.38 204,67.4 XB1.5
N$36
  Bottom 0.61: JP3.5 203.06,65.84 203.5,65.4 XB1.6
N$37
  Bottom 0.61: JP3.2 203.32,58.22 204.5,59.4 XB1.9
N$38
  Bottom 0.61: XB1.20 230.81,75.41 234,78.6 235.93,78.6 JP4.1
N$39
  Bottom 0.813: D1.C 126.12,102.85 C1.+ 126.3,102.67 126.3,106.3 129.35,109.35 7805.IN
N$40
  Bottom 0.61: XB1.19 231.11,73.41 233.7,76 JP4.2
N$41
  Bottom 0.813: LED1.A 153.96,109.51 R1.2
N$42
  Bottom 0.61: R7.2 LED6.A
N$43
  Bottom 0.61: XB1.18 231.61,71.41 233.7,73.5 235.95,73.5 JP4.3
N$44
  Bottom 0.61: XB1.17 232.21,69.41 233.6,70.8 235.87,70.8 JP4.4
N$45
  Bottom 0.61: XB1.11 231.29,57.41 233,55.7 235.97,55.7 JP4.10
N$46
  Bottom 0.61: XB1.12 231.99,59.41 233.3,58.1 235.87,58.1 JP4.9
N$47
  Bottom 0.813: POWER.4 POWER.2 105.33,101.43 D1.A
N$48
  Bottom 0.61: XB1.14 233.69,63.41 234,63.1 235.79,63.1 JP4.7
N$50
  Bottom 0.61: XB1.15 233.41,65.41 233.8,65.8 235.95,65.8 JP4.6
N$51
  Bottom 0.61: XB1.16 232.71,67.41 233.7,68.4 235.97,68.4 JP4.5
N$52
  Bottom 0.61: IC1.24 116.09,63.21 117.3,62 119.2,62 120.7,60.5 120.7,55.3 116.4,51 112.9,51 111,49.1 111,42.18 DIS1.4
N$53
  Bottom 0.813: IC1.21 108.47,59.83 R5.1
N$54
  Bottom 0.813: JP2.1 113.57,65.56 IC1.23
N$55
  Bottom 0.61: R9.2 16.8,48.58 R10.1 20.52,48.48 23.4,45.6 23.4,37.93 IC4.1
N$56
  Bottom 0.813: JP2.2 111.03,65.56 IC1.22
N$57
  Bottom 0.813: IC1.15 121.17,86.32 SERIAL.1
N$58
  Bottom 0.813: IC1.14 123.71,86.32 SERIAL.2
N$59
  Bottom 0.813: JP6.3 IC1.16
N$60
  Bottom 0.813: IC1.17 JP6.2
N$61
  Bottom 0.813: JP6.1 IC1.18
N$62
  Bottom 0.61: ISP-DOWNLOADER.2 143.77,71.83 136.4,79.2 136.3,80.71 IC1.9
  Bottom 0.813: IC1.9 136.41,84.48 RESET.1 RESET.2
N$63
  Bottom 0.61: IC1.12 128.73,80.76 Q1.2 129.98,74.7 C3.2
N$64
  Bottom 0.61: IC1.13 126.25,76.05 Q1.1 122.81,74.29 C4.2
N$65
  Bottom 0.61: D3.C D4.A 197.9,25.4 198.5,26 210.3,26 | OUT1.1 210.97,26.67 210.3,26 | IC3.2 209.8,22.44 209.8,25.5 210.3,26
N$66
  Bottom 0.61: IC3.5 213.69,14.81 216.9,11.6 216.9,9.4 IN1.2
N$67
  Bottom 0.61: IC3.7 216.23,14.27 219.5,11 219.5,9.34 IN1.3
N$68
  Bottom 0.406: 216.1,33.8 216.1,30.1
  Bottom 0.61: IN1.1 214.46,10.44 212.8,12.1 199.1,12.1 194.7,16.5 194.7,26.1 197.5,28.9 205.1,28.9 206.5,30.3 206.5,33.5 207.6,34.6 215.3,34.6 216.1,33.8 | 216.1,30.1 216.1,25.6 215,24.5 215,22.4 IC3.6
N$69
  Bottom 0.61: IC3.11 221.31,13.49 222.4,12.4 222.4,7.5 224.7,5.2 239,5.2 242.7,8.9 242.7,26.1 240,28.8 230.9,28.8 229.2,30.5 229.2,33.9 228.1,35 222.4,35 221.2,33.8 221.2,32.46 IN2.1
N$70
  Bottom 0.61: IC3.10 220.04,25.94 223.9,29.8 IN2.2
N$71
  Bottom 0.61: IC3.12 222.58,25.98 226.4,29.8 226.4,32.26 IN2.3
N$72
  Bottom 0.61: R12.1 56.1,58.93 IN-RELAY.2
N$73
  Bottom 0.61: ISP-DOWNLOADER.3 143.13,74.27 139,78.4 139,80.77 IC1.8
  Bottom 0.813: JP7.1 138.95,86.4 IC1.8
N$74
  Bottom 0.61: D6.A D5.C 202.4,15.9 202.7,15.6 | IC3.3 211.3,17.13 211.3,14.4 210.5,13.6 204.7,13.6 202.7,15.6 | 202.7,15.6 197.7,15.6 196,17.3 196,25.3 198.2,27.6 207.1,27.6 208.4,28.9 208.4,32.07 OUT1.2
N$75
  Bottom 0.61: 166.8,65.58 IC1.40 | 166.8,65.58 170.1,65.58 R8.2 | 166.8,65.58 166.47,65.25 SENSOR-CO.6 SENSOR-CO.4
N$76
  Bottom 0.61: D8.A D7.C 233.1,18.58 233.1,17.3 229.2,13.4 224,13.4 223.93,13.47 | OUT2.1 223.93,13.47 | IC3.13 223.93,17.2 223.93,13.47
N$77
  Bottom 0.61: ISP-DOWNLOADER.5 160.15,79.35 158.5,77.7 145.5,77.7 144,79.2 144,80.79 IC1.6
  Bottom 0.813: MOTOR.1 144.05,80.84 IC1.6
N$78
  Bottom 0.61: D10.A D9.C 237.6,15.7 233.7,11.8 227.5,11.8 | OUT2.2 226.47,10.77 227.5,11.8 | 227.5,11.8 227.5,11.6 226.4,10.5 226.4,7.5 227.5,6.4 238.2,6.4 241.2,9.4 241.2,25.5 239.3,27.4 227.7,27.4 225.1,24.8 225.1,22.38 IC3.14
N$79
  Bottom 0.61: IN-RELAY.1 58.57,56.53 60.5,54.6 72.18,54.6 R13.1
N$80
  Bottom 0.61: R6.1 161.3,50.2 162.6,51.5 162.6,54.93 SENSOR-CO.1 164.6,56.93 164.6,61.2 163.19,62.61 SENSOR-CO.3
N$81
  Bottom 0.61: R11.1 6.5,27.97 LED7.A
N$82
  Bottom 0.61: R12.2 T1.3
N$83
  pour Bottom (isolate 1.016): 1.6,59.8 1.7,4.9 84.8,4.9 84.8,61.3 1.5,61.3
N$84
  Bottom 0.61: R13.2 T2.3
N$85
  Bottom 0.61: JP5.2 17.83,55.77 28.6,45 28.6,38.05 IC4.3 28.5,37.83 28.5,30.7 29.93,29.27 C7.+ 30.83,29.3 41.7,29.3 42.11,28.89 K2.1 42.3,28.56 42.3,28.4 42.6,28.1 42.6,26.6 44.6,24.6 63.6,24.6 65.23,26.23 K1.1 69.17,28.69 K1.P 71.2,25.4 72.3,24.3 78.4,24.3 81.6,27.5 81.6,50.9 80.72,51.78 D11.C 79.5,51.68 79.5,49.9 78.1,48.5 61.2,48.5 60.1,49.6 D12.C
N$86  (via drill 0.6)
  Top 0.61: v62.5,41.1 62.5,35.2 v62.4,35.1
  Bottom 0.61: T2.2 68.2,41.62 68.2,44.4 67.3,45.3 61.5,45.3 60.1,43.9 D12.A 60.1,41.5 60.4,41.2 62.4,41.2 v62.5,41.1 | v62.4,35.1 62.4,31.3 59.9,28.8 54.66,28.8 K2.2
N$87
  Bottom 0.61: T1.2 48.5,39 50.5,37 74.5,37 | 74.5,37 76.9,34.6 76.9,28.96 K1.2 | 74.5,37 77.8,37 79.4,38.6 D11.A | D11.A 79.4,41.9 79.7,42.2 79.7,41.92 D11.A
N$94
  Bottom 0.61: K2.S 42.63,14.07 44.2,12.5 63.5,12.5 65.3,14.3 65.3,16.43 K1.S 65.23,18.13 68.6,21.5 79.1,21.5 83.3,25.7 83.3,54.6 78.9,59 62,59 OUT-RELAY.1
PE
  Bottom 0.406: IC3.1 208.61,18.81 209.5,19.7 217.2,19.7 | 217.2,19.7 225,19.7 226.3,18.4 226.3,17.37 IC3.15 | IC3.8 217.5,20 217.2,19.7
  Bottom 0.61: D3.A D5.A 203.38,9.5 POWER-M-IN.2 203.3,9.5 202.3,8.5 197.7,8.5 193.5,12.7 193.5,27.2 196.9,30.6 204.1,30.6 204.9,31.4 204.9,33.9 206.9,35.9 215.9,35.9 217.3,34.5 217.3,32.27 POWER-M-OUT.1 217.5,32.07 IC3.8 | D7.A D9.A 239.9,10.82 239.9,24.7 238.8,25.8 232.1,25.8 230.4,24.1 230.4,18.5 229.18,17.28 IC3.15 | IC3.1 208.63,17.26
  pour Bottom (isolate 1.016): 189.6,38.8 246.2,38.8 246.2,1.1 189.6,1.1
V+  (via drill 0.6)  (1 unrouted)
  Top 0.61: v31.9,33.2 v26,33.2 25.9,33.2
  Bottom 0.61: R11.2 6.5,40.7 8.7,38.5 13.42,38.5 R9.1 13.5,32.3 16.7,29.1 20.67,29.1 C8.+ 20.73,29.1 24,29.1 25.9,31 IC4.2 | K2.P 48.6,31.8 47.3,33.1 32,33.1 v31.9,33.2
VCC
  Bottom 0.61: D6.C D4.C | D10.C D8.C 232.52,33.48 229.2,36.8 | 229.2,36.8 228.9,37.1 204.8,37.1 202.4,34.7 D6.C | 202.5,33.5 D6.C | 202.2,33.4 202.5,33.5 | 202.2,33.4 D6.C | 229.2,36.8 229.2,36.9 229,37.1 204.9,37.1 202.5,34.7 202.5,33.5 | 202.5,33.5 202.5,33.4 202.2,33.4 | 202.2,33.4 197.3,33.4 192.1,28.2 192.1,10.8 196.5,6.4 209.8,6.4 | 209.8,6.4 211.2,7.8 211.2,9.47 POWER-M-IN.1 | IC3.9 218.77,13.93 221.2,11.5 221.2,7.5 220.1,6.4 209.8,6.4
(copper drawn outside any net)
  shapes: Bottom circle x12